# EAGLE design controller (EAGLE 6.4)
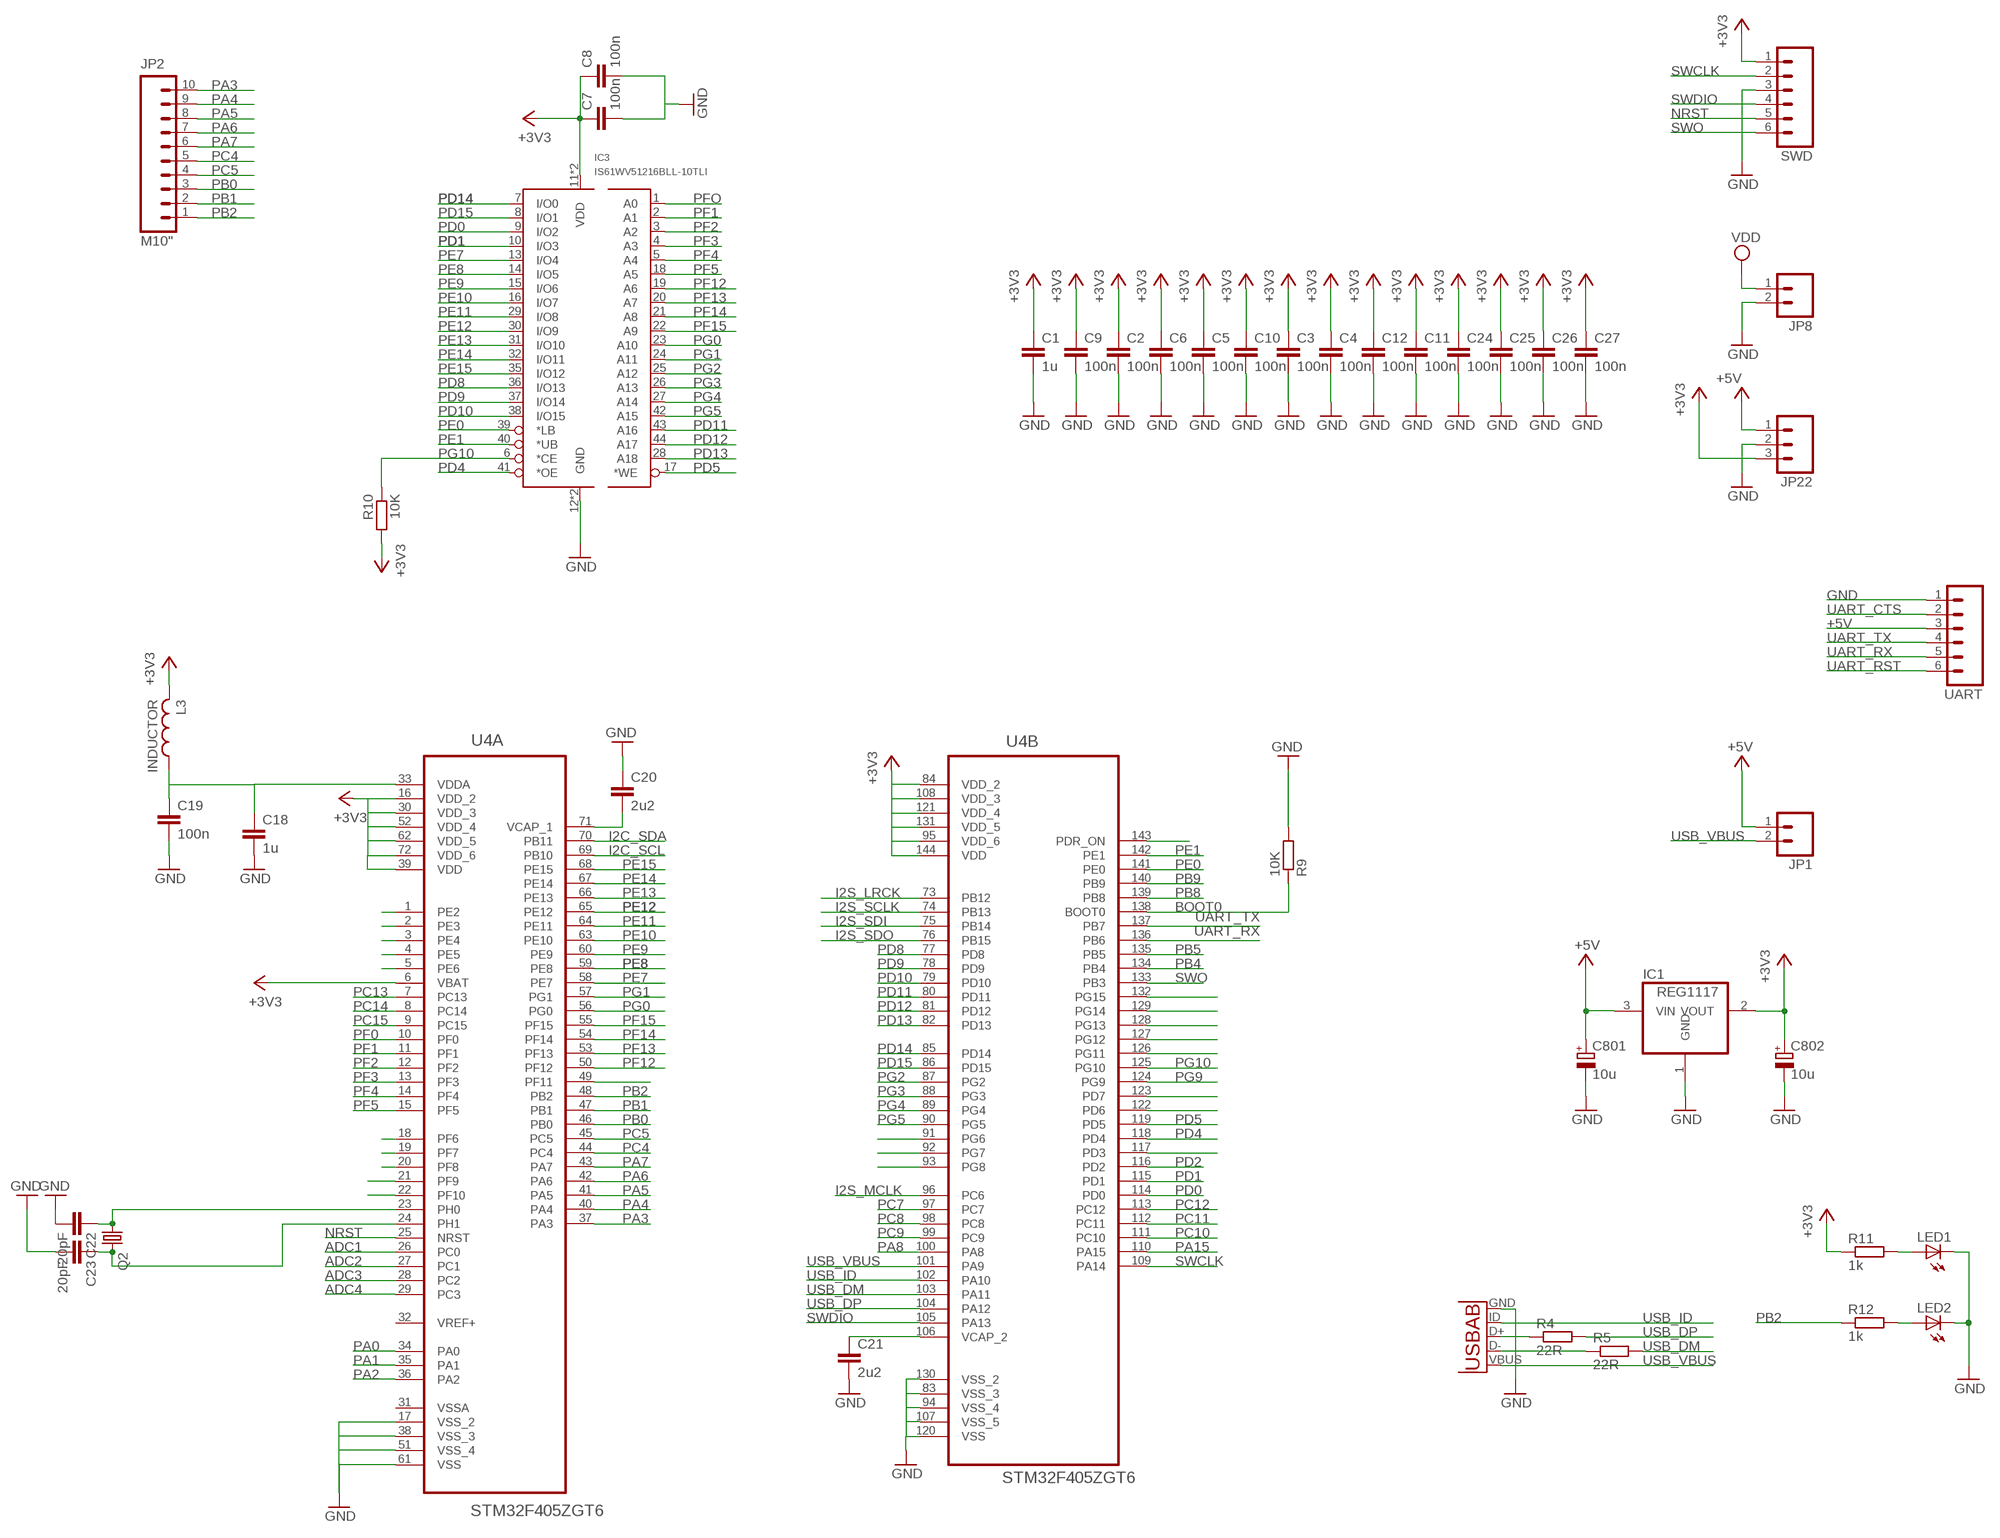
[diagram p0: schematic, sheet 1]

## Parts
C1  1u  C-EUC0603  [C0603]
C2  100n  C-EUC0603  [C0603]
C3  100n  C-EUC0603  [C0603]
C4  100n  C-EUC0603  [C0603]
C5  100n  C-EUC0603  [C0603]
C6  100n  C-EUC0603  [C0603]
C7  100n  C-EUC0603  [C0603]
C8  100n  C-EUC0603  [C0603]
C9  100n  C-EUC0603  [C0603]
C10  100n  C-EUC0603  [C0603]
C11  100n  C-EUC0603  [C0603]
C12  100n  C-EUC0603  [C0603]
C18  1u  C-EUC0603  [C0603]
C19  100n  C-EUC0603  [C0603]
C20  2u2  C-EUC0603  [C0603]
C21  2u2  C-EUC0603  [C0603]
C22  20pF  C-EUC0603  [C0603]
C23  20pF  C-EUC0603  [C0603]
C24  100n  C-EUC0603  [C0603]
C25  100n  C-EUC0603  [C0603]
C26  100n  C-EUC0603  [C0603]
C27  100n  C-EUC0603  [C0603]
C801  10u  CPOL-EUA  [PANASONIC_A]
C802  10u  CPOL-EUA  [PANASONIC_A]
IC1  REG1117  [SOT223]
IC3  IS61WV51216BLL-10TLI  [TSOP44-II]
JP1  M02PTH  [1X02]
JP2  M10"  [1X10]
JP8  M02PTH  [1X02]
JP22  M03PTH  [1X03]
L3  INDUCTOR  [0603]
LED1  LED1206  [LED-1206]
LED2  LED1206  [LED-1206]
Q2  CRYSTALHC49UP  [HC49UP]
R4  22R  R-EU_R0603  [R0603]
R5  22R  R-EU_R0603  [R0603]
R9  10K  R-EU_R0603  [R0603]
R10  10K  R-EU_R0603  [R0603]
R11  1k  R-EU_R0603  [R0603]
R12  1k  R-EU_R0603  [R0603]
SWD  M06SIP  [1X06]
U3  USB-AB  [USB-AB-MICRO-SMD]
U4  STM32F405ZGT6  [QFP50P2200X2200X160-144N]
UART  M06SIP  [1X06]

## Nets
+3V3: C1.1 C2.1 C3.1 C4.1 C5.1 C6.1 C7.1 C8.1 C9.1 C10.1 C11.1 C12.1 C24.1 C25.1 C26.1 C27.1 C802.+ IC1.2(VOUT) IC3.11(VDD) IC3.33(VDD) JP22.3 L3.2 R10.2 R11.1 SWD.1 U4.6(A:VBAT) U4.16(A:VDD_2) U4.30(A:VDD_3) U4.39(A:VDD) U4.52(A:VDD_4) U4.62(A:VDD_5) U4.72(A:VDD_6) U4.84(B:VDD_2) U4.95(B:VDD_6) U4.108(B:VDD_3) U4.121(B:VDD_4) U4.131(B:VDD_5) U4.144(B:VDD)
+5V: C801.+ IC1.3(VIN) JP1.1 JP22.1 UART.3
ADC1: U4.26(A:PC0)
ADC2: U4.27(A:PC1)
ADC3: U4.28(A:PC2)
ADC4: U4.29(A:PC3)
BOOT0: R9.1 U4.138(B:BOOT0)
GND: C1.2 C2.2 C3.2 C4.2 C5.2 C6.2 C7.2 C8.2 C9.2 C10.2 C11.2 C12.2 C18.2 C19.2 C20.1 C21.2 C22.2 C23.2 C24.2 C25.2 C26.2 C27.2 C801.- C802.- IC1.1(GND) IC3.12(GND) IC3.34(GND) JP8.2 JP22.2 LED1.C LED2.C R9.2 SWD.3 U3.GND U4.17(A:VSS_2) U4.38(A:VSS_3) U4.51(A:VSS_4) U4.61(A:VSS) U4.83(B:VSS_3) U4.94(B:VSS_4) U4.107(B:VSS_5) U4.120(B:VSS) U4.130(B:VSS_2) UART.1
I2C_SCL: U4.69(A:PB10)
I2C_SDA: U4.70(A:PB11)
I2S_LRCK: U4.73(B:PB12)
I2S_MCLK: U4.96(B:PC6)
I2S_SCLK: U4.74(B:PB13)
I2S_SDI: U4.75(B:PB14)
I2S_SDO: U4.76(B:PB15)
N$6: U4.49(A:PF11)
N$10: LED1.A R11.2
N$11: LED2.A R12.2
N$12: C21.1 U4.106(B:VCAP_2)
N$14: U4.21(A:PF9)
N$15: U4.22(A:PF10)
N$17: R4.1 U3.D+
N$21: R5.1 U3.D-
N$23: C23.1 Q2.2 U4.24(A:PH1)
N$24: C22.1 Q2.1 U4.23(A:PH0)
N$53: C20.2 U4.71(A:VCAP_1)
N$54: U4.91(B:PG6)
N$75: U4.128(B:PG13)
N$76: U4.129(B:PG14)
N$77: U4.132(B:PG15)
N$99: U4.117(B:PD3)
N$102: U4.122(B:PD6)
N$103: U4.123(B:PD7)
N$106: U4.126(B:PG11)
N$107: U4.127(B:PG12)
N$113: U4.143(B:PDR_ON)
N$123: U4.19(A:PF7)
N$124: U4.18(A:PF6)
N$136: U4.5(A:PE6)
N$137: U4.4(A:PE5)
N$138: U4.3(A:PE4)
N$139: U4.2(A:PE3)
N$140: U4.1(A:PE2)
N$142: U4.93(B:PG8)
N$143: U4.92(B:PG7)
NRST: SWD.5 U4.25(A:NRST)
PA0: U4.34(A:PA0)
PA1: U4.35(A:PA1)
PA2: U4.36(A:PA2)
PA3: JP2.10 U4.37(A:PA3)
PA4: JP2.9 U4.40(A:PA4)
PA5: JP2.8 U4.41(A:PA5)
PA6: JP2.7 U4.42(A:PA6)
PA7: JP2.6 U4.43(A:PA7)
PA8: U4.100(B:PA8)
PA15: U4.110(B:PA15)
PB0: JP2.3 U4.46(A:PB0)
PB1: JP2.2 U4.47(A:PB1)
PB2: JP2.1 R12.1 U4.48(A:PB2)
PB4: U4.134(B:PB4)
PB5: U4.135(B:PB5)
PB8: U4.139(B:PB8)
PB9: U4.140(B:PB9)
PC4: JP2.5 U4.44(A:PC4)
PC5: JP2.4 U4.45(A:PC5)
PC7: U4.97(B:PC7)
PC8: U4.98(B:PC8)
PC9: U4.99(B:PC9)
PC10: U4.111(B:PC10)
PC11: U4.112(B:PC11)
PC12: U4.113(B:PC12)
PC13: U4.7(A:PC13)
PC14: U4.8(A:PC14)
PC15: U4.9(A:PC15)
PD0: IC3.9(I/O2) U4.114(B:PD0)
PD1: IC3.10(I/O3) U4.115(B:PD1)
PD2: U4.116(B:PD2)
PD4: IC3.41(*OE) U4.118(B:PD4)
PD5: IC3.17(*WE) U4.119(B:PD5)
PD8: IC3.36(I/O13) U4.77(B:PD8)
PD9: IC3.37(I/O14) U4.78(B:PD9)
PD10: IC3.38(I/O15) U4.79(B:PD10)
PD11: IC3.43(A16) U4.80(B:PD11)
PD12: IC3.44(A17) U4.81(B:PD12)
PD13: IC3.28(A18) U4.82(B:PD13)
PD14: IC3.7(I/O0) U4.85(B:PD14)
PD15: IC3.8(I/O1) U4.86(B:PD15)
PE0: IC3.39(*LB) U4.141(B:PE0)
PE1: IC3.40(*UB) U4.142(B:PE1)
PE7: IC3.13(I/O4) U4.58(A:PE7)
PE8: IC3.14(I/O5) U4.59(A:PE8)
PE9: IC3.15(I/O6) U4.60(A:PE9)
PE10: IC3.16(I/O7) U4.63(A:PE10)
PE11: IC3.29(I/O8) U4.64(A:PE11)
PE12: IC3.30(I/O9) U4.65(A:PE12)
PE13: IC3.31(I/O10) U4.66(A:PE13)
PE14: IC3.32(I/O11) U4.67(A:PE14)
PE15: IC3.35(I/O12) U4.68(A:PE15)
PF0: U4.10(A:PF0)
PF1: IC3.2(A1) U4.11(A:PF1)
PF2: IC3.3(A2) U4.12(A:PF2)
PF3: IC3.4(A3) U4.13(A:PF3)
PF4: IC3.5(A4) U4.14(A:PF4)
PF5: IC3.18(A5) U4.15(A:PF5)
PF9: U4.20(A:PF8)
PF12: IC3.19(A6) U4.50(A:PF12)
PF13: IC3.20(A7) U4.53(A:PF13)
PF14: IC3.21(A8) U4.54(A:PF14)
PF15: IC3.22(A9) U4.55(A:PF15)
PFO: IC3.1(A0)
PG0: IC3.23(A10) U4.56(A:PG0)
PG1: IC3.24(A11) U4.57(A:PG1)
PG2: IC3.25(A12) U4.87(B:PG2)
PG3: IC3.26(A13) U4.88(B:PG3)
PG4: IC3.27(A14) U4.89(B:PG4)
PG5: IC3.42(A15) U4.90(B:PG5)
PG9: U4.124(B:PG9)
PG10: IC3.6(*CE) R10.1 U4.125(B:PG10)
SWCLK: SWD.2 U4.109(B:PA14)
SWDIO: SWD.4 U4.105(B:PA13)
SWO: SWD.6 U4.133(B:PB3)
UART_CTS: UART.2
UART_RST: UART.6
UART_RX: U4.136(B:PB6) UART.5
UART_TX: U4.137(B:PB7) UART.4
USB_DM: R5.2 U4.103(B:PA11)
USB_DP: R4.2 U4.104(B:PA12)
USB_ID: U3.ID(USBID) U4.102(B:PA10)
USB_VBUS: JP1.2 U3.VBUS U4.101(B:PA9)
VDD: JP8.1
VDDA: C18.1 C19.1 L3.1 U4.33(A:VDDA)
Unconnected: U4.32(A:VREF+)

## Power pins joined to a net without a drawn wire
VSSA: U4.31(A:VSSA)

## Library data of the parts
C1-C12 C18-C27 = resistor:C-EU: CAPACITOR, European symbol
C801 C802 = resistor:CPOL-EU: POLARIZED CAPACITOR, European symbol
IC1 = burr-brown:REG1117: 800mA and 1A Low Dropout (LDO) Positive Regulator 1.8V, 2.5V, 2.85V, 3.3V, 5V, and Adj; MPN: REG1117; OC_FARNELL: 1097566; OC_NEWARK: 14P6981
IC3 = Rebel:IS61WV51216BLL-10TLI: IS61WV51216BLL-10TLI - SRAM, 8MBIT, 10NS, 44TSOPII Manufacturer: INTEGRATED SILICON SOLUTION (ISSI) Farnell order code: 2253837 Manufacturer Part No: IS61WV51216BLL-10TLI Product Information SRAM, 8MBIT, 10NS, 44TSOPII Memory Size: 8Mbit Memory Configuration: 512K x 16bit Supply Voltage Min: 2.4V Supply Voltage Max: 3.6V Memory Case Style: TSOPII No. of Pins: 44 Access Time: 10ns Operating Temperature Min: -40°C Operating Temperature Max: 85°C MSL: MSL 3 - 168 hours SVHC: No SVHC (19-Dec-2012) Operating Temperature Range: -40°C to +85°C Supply Voltage Range: 2.4V to 3.6V
JP1 JP8 = SparkFun:M02: Header 2 Standard 2-pin 0.1" header. Use with straight break away headers (SKU : PRT-00116), right angle break away headers (PRT-00553), swiss pins (PRT-00743), machine pins (PRT-00117), and female headers (PRT-00115). Molex polarized connector foot print use with SKU : PRT-08233 with associated crimp pins and housings.
JP2 = SparkFun:M10: Header 10 Standard 10-pin 0.1" header. Use with straight break away headers (SKU : PRT-00116), right angle break away headers (PRT-00553), swiss pins (PRT-00743), machine pins (PRT-00117), and female headers (PRT-00115).
JP22 = SparkFun:M03: Header 3 Standard 3-pin 0.1" header. Use with straight break away headers (SKU : PRT-00116), right angle break away headers (PRT-00553), swiss pins (PRT-00743), machine pins (PRT-00117), and female headers (PRT-00115). Molex polarized connector foot print use with SKU : PRT-08232 with associated crimp pins and housings.
L3 = Rebel:INDUCTOR
LED1 LED2 = SparkFun:LED: LEDs Standard schematic elements and footprints for 5mm, 3mm, 1206, and 0603 sized LEDs. 5mm - Spark Fun Electronics SKU : COM-00529 (and others)
Q2 = crystal:CRYSTAL: CRYSTAL; OC_FARNELL: unknown; OC_NEWARK: unknown
R4 R5 R9-R12 = resistor:R-EU_: RESISTOR, European symbol
SWD UART = SparkFun:M06: Header 6 Standard 6-pin 0.1" header. Use with straight break away headers (SKU : PRT-00116), right angle break away headers (PRT-00553), swiss pins (PRT-00743), machine pins (PRT-00117), and female headers (PRT-00115). Molex polarized connector foot print use with SKU : PRT-08094 with associated crimp pins and housings. NOTES ON THE VARIANTS LOCK and LOCK_LONGPADS... This footprint was designed to help hold the alignment of a through-hole component (i.e. 6-pin header) while soldering it into place. You may notice that each hole has been shifted either up or down by 0.005 of an inch from it's more standard position (which is a perfectly straight line). This slight alteration caused the pins (the squares in the middle) to touch the edges of the holes. Because they are alternating, it causes a "brace" to hold the component in place. 0.005 has proven to be the perfect amount of "off-center" position when using our standard breakaway headers. Although looks a little odd when you look at the bare footprint, once you have a header in there, the alteration is very hard to notice. Also, if you push a header all the way into place, it is covered up entirely on the bottom side. This idea of altering the position of holes to aid alignment will be further integrated into the Sparkfun Library for other footprints. It can help hold any component with 3 or more connection pins.
U3 = SparkFun-Connectors:USB-AB: This is a USB AB connector that is compatible with USB OTG. i.e. this connector can serve as a host or device
U4 = Rebel:STM32F405ZGT6: IC, MCU, 32BIT, 1MB FLASH, 144LQFP; MPN: STM32F405ZGT6; OC_FARNELL: 2215225; OC_NEWARK: 46W2200; PACKAGE: 144LQFP; SUPPLIER: STMicroelectronics

## Board
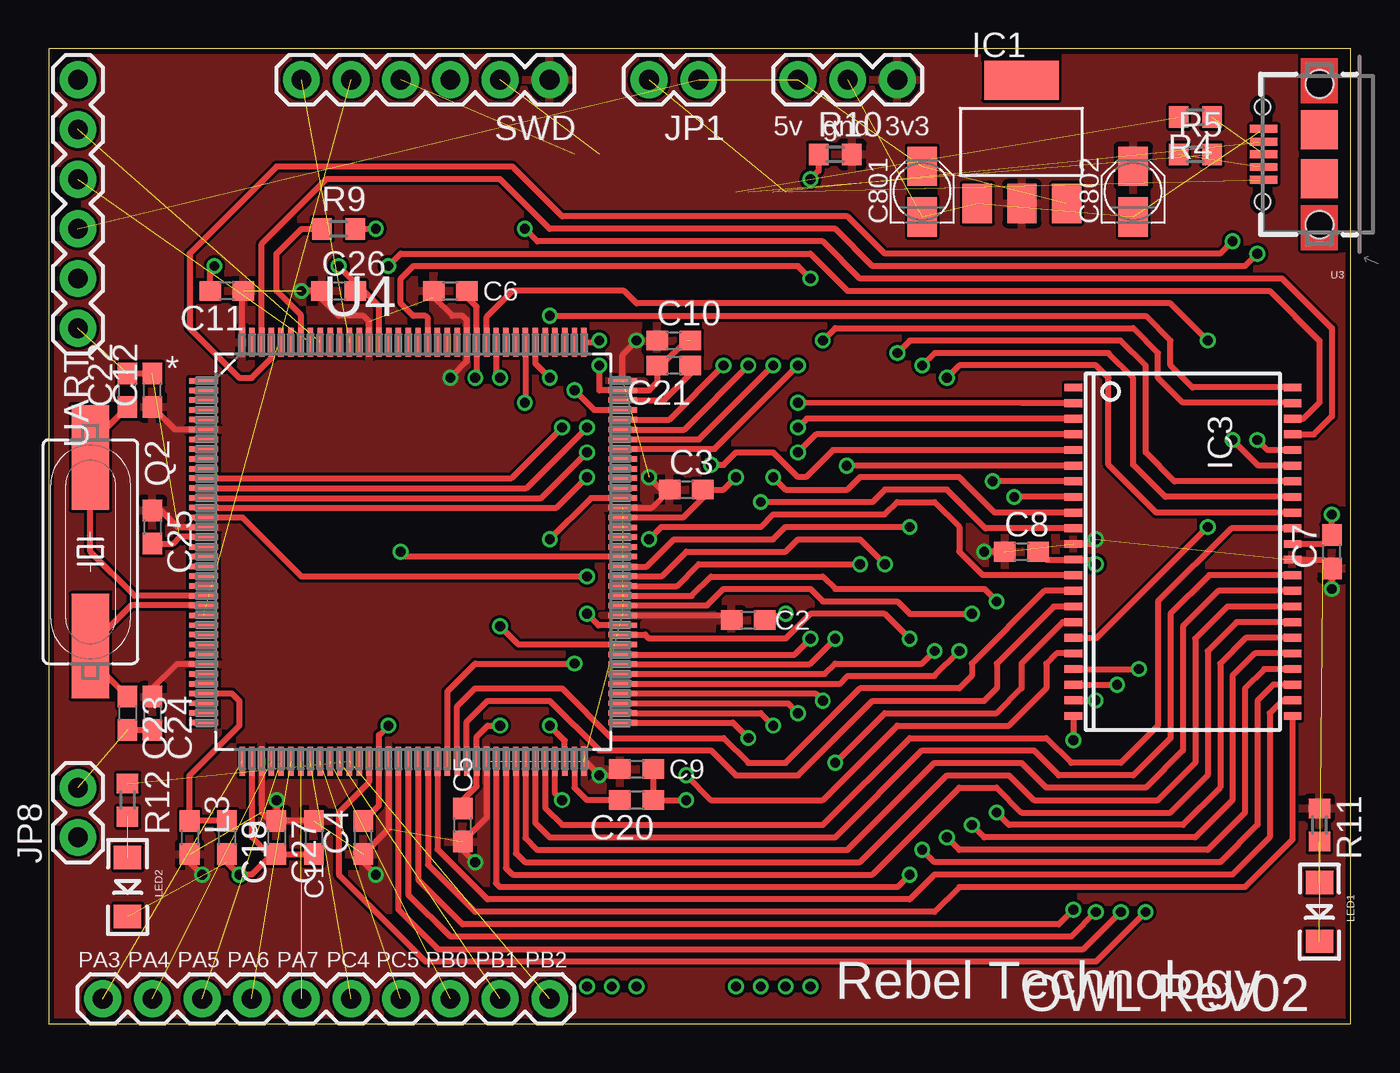
[diagram p1: board, top side]
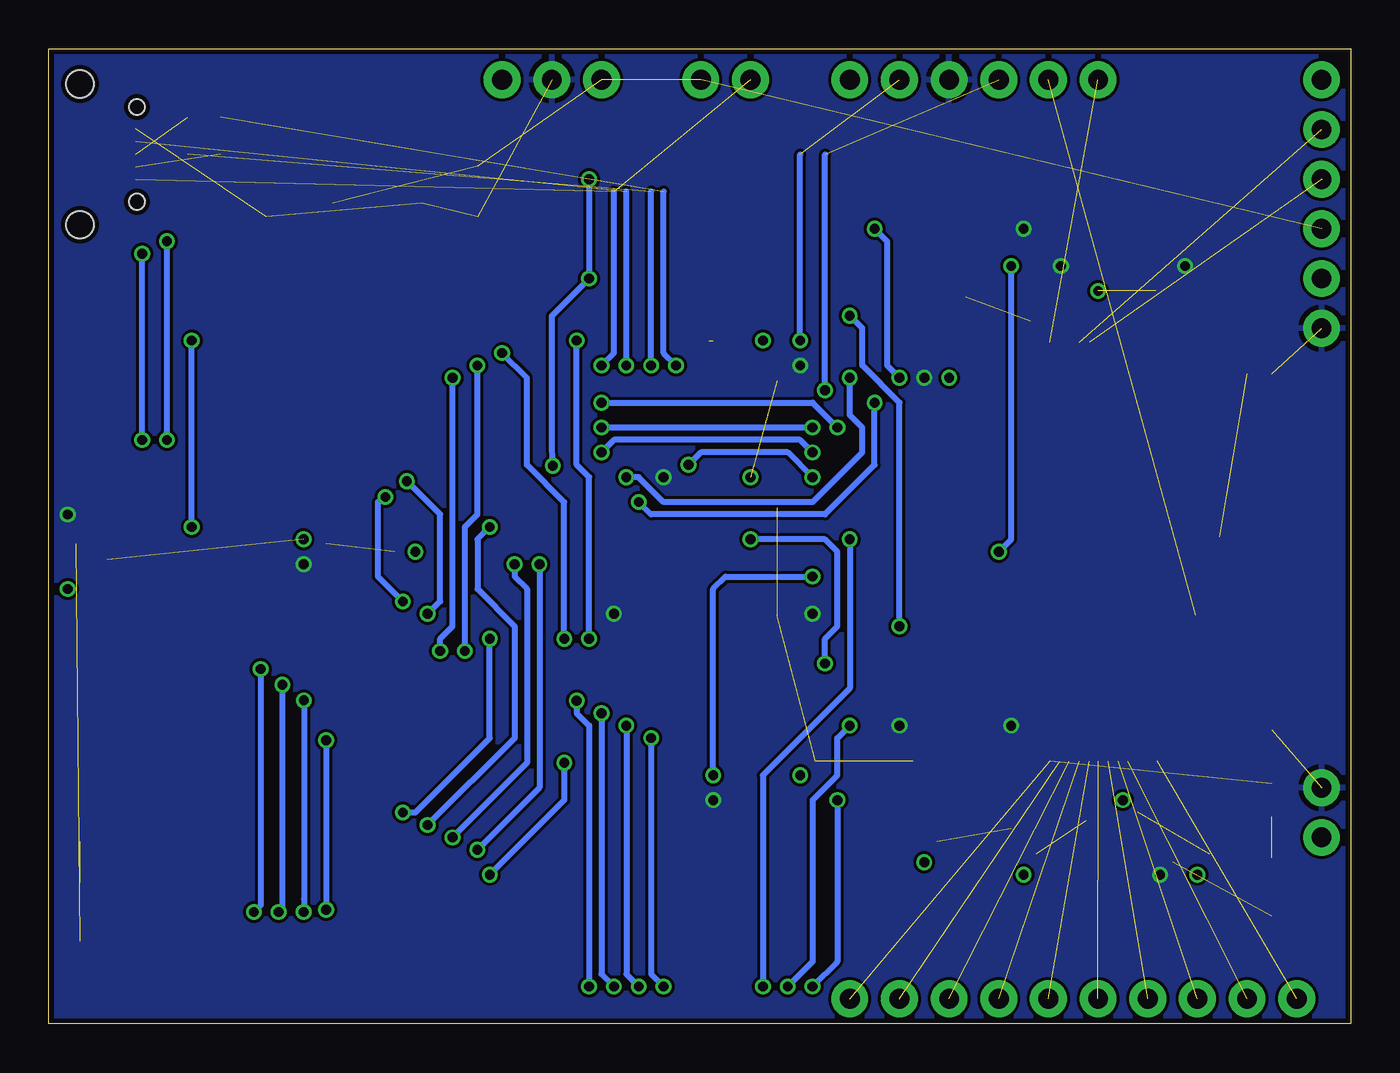
[diagram p2: board, bottom side, seen from below]

Size 66.58 x 49.84 mm. Coordinates in mm from the lower left corner, seen from the top.
Outline: 0,0 66.58,0 66.58,49.84 0,49.84 0,0
Copper layers (1*16): Top 0.035mm / dielectric 1.5mm / Bottom 0.035mm
Design rules "default *": minimum track width 6mil, minimum drill 12mil, track to track 6mil, track to pad 6mil, pad to pad 6mil, via to via 6mil, smd to smd 0mil, copper to edge 10mil, drill to drill 10mil, minimum pad ring 12mil, minimum via ring 6mil, stop-mask expansion 2mil, vias tented up to drill 100mil, thermal gap 10mil

### Footprints (pad centres in the part's own frame; a part is rotated, then mirrored left to right if it is on the bottom)
C0603 = smd 1.1 x 1: 1 -0.85,0; 2 0.85,0
PANASONIC_A = smd 2 x 1.5: + 1.3,0; - -1.3,0
SOT223 = smd 1.499 x 2.007: 1 -2.261,-3.15; 2 0.025,-3.15; 3 2.311,-3.15 | smd 3.81 x 2.007: 4 0,3.15
TSOP44-II = smd 0.4 x 0.9: 1 -8.4,-5.6; 2 -7.6,-5.6; 3 -6.8,-5.6; 4 -6,-5.6; 5 -5.2,-5.6; 6 -4.4,-5.6; 7 -3.6,-5.6; 8 -2.8,-5.6; 9 -2,-5.6; 10 -1.2,-5.6; 11 -0.4,-5.6; 12 0.4,-5.6; 13 1.2,-5.6; 14 2,-5.6; 15 2.8,-5.6; 16 3.6,-5.6; 17 4.4,-5.6; 18 5.2,-5.6; 19 6,-5.6; 20 6.8,-5.6; 21 7.6,-5.6; 22 8.4,-5.6; 23 8.4,5.6; 24 7.6,5.6; 25 6.8,5.6; 26 6,5.6; 27 5.2,5.6; 28 4.4,5.6; 29 3.6,5.6; 30 2.8,5.6; 31 2,5.6; 32 1.2,5.6; 33 0.4,5.6; 34 -0.4,5.6; 35 -1.2,5.6; 36 -2,5.6; 37 -2.8,5.6; 38 -3.6,5.6; 39 -4.4,5.6; 40 -5.2,5.6; 41 -6,5.6; 42 -6.8,5.6; 43 -7.6,5.6; 44 -8.4,5.6
1X02 = drill 1.016 pad 1.88: 1 0,0; 2 2.54,0
1X10 = drill 1.016 pad 1.88: 1 0,0; 2 2.54,0; 3 5.08,0; 4 7.62,0; 5 10.16,0; 6 12.7,0; 7 15.24,0; 8 17.78,0; 9 20.32,0; 10 22.86,0
1X03 = drill 1.016 pad 1.88: 1 0,0; 2 2.54,0; 3 5.08,0
0603 = smd 1.1 x 1: 1 -0.85,0; 2 0.85,0
LED-1206 = smd 1.2 x 1.4: A -1.5,0; C 1.5,0
HC49UP = smd 5.334 x 1.93: 1 -4.826,0; 2 4.826,0
R0603 = smd 1 x 1.1: 1 -0.85,0; 2 0.85,0
1X06 = drill 1.016 pad 1.88: 1 0,0; 2 2.54,0; 3 5.08,0; 4 7.62,0; 5 10.16,0; 6 12.7,0
USB-AB-MICRO-SMD = smd 1.4 x 0.4: D+ 2.85,0; D- 2.85,0.65; GND 2.85,-1.3; ID 2.85,-0.65; VBUS 2.85,1.3 | smd 1.9 x 2: P$6 0,1.25; P$7 0,-1.25 | hole 1.4: 0,3.6; 0,-3.6 | hole 0.8: 2.9,2.425; 2.9,-2.425
QFP50P2200X2200X160-144N = smd 1.473 x 0.279: 1 -10.719,8.738; 2 -10.719,8.255; 3 -10.719,7.747; 4 -10.719,7.239; 5 -10.719,6.756; 6 -10.719,6.248; 7 -10.719,5.74; 8 -10.719,5.258; 9 -10.719,4.75; 10 -10.719,4.242; 11 -10.719,3.759; 12 -10.719,3.251; 13 -10.719,2.743; 14 -10.719,2.261; 15 -10.719,1.753; 16 -10.719,1.245; 17 -10.719,0.762; 18 -10.719,0.254; 19 -10.719,-0.254; 20 -10.719,-0.762; 21 -10.719,-1.245; 22 -10.719,-1.753; 23 -10.719,-2.261; 24 -10.719,-2.743; 25 -10.719,-3.251; 26 -10.719,-3.759; 27 -10.719,-4.242; 28 -10.719,-4.75; 29 -10.719,-5.258; 30 -10.719,-5.74; 31 -10.719,-6.248; 32 -10.719,-6.756; 33 -10.719,-7.239; 34 -10.719,-7.747; 35 -10.719,-8.255; 36 -10.719,-8.738; 73 10.719,-8.738; 74 10.719,-8.255; 75 10.719,-7.747; 76 10.719,-7.239; 77 10.719,-6.756; 78 10.719,-6.248; 79 10.719,-5.74; 80 10.719,-5.258; 81 10.719,-4.75; 82 10.719,-4.242; 83 10.719,-3.759; 84 10.719,-3.251; 85 10.719,-2.743; 86 10.719,-2.261; 87 10.719,-1.753; 88 10.719,-1.245; 89 10.719,-0.762; 90 10.719,-0.254; 91 10.719,0.254; 92 10.719,0.762; 93 10.719,1.245; 94 10.719,1.753; 95 10.719,2.261; 96 10.719,2.743; 97 10.719,3.251; 98 10.719,3.759; 99 10.719,4.242; 100 10.719,4.75; 101 10.719,5.258; 102 10.719,5.74; 103 10.719,6.248; 104 10.719,6.756; 105 10.719,7.239; 106 10.719,7.747; 107 10.719,8.255; 108 10.719,8.738 | smd 0.279 x 1.473: 37 -8.738,-10.719; 38 -8.255,-10.719; 39 -7.747,-10.719; 40 -7.239,-10.719; 41 -6.756,-10.719; 42 -6.248,-10.719; 43 -5.74,-10.719; 44 -5.258,-10.719; 45 -4.75,-10.719; 46 -4.242,-10.719; 47 -3.759,-10.719; 48 -3.251,-10.719; 49 -2.743,-10.719; 50 -2.261,-10.719; 51 -1.753,-10.719; 52 -1.245,-10.719; 53 -0.762,-10.719; 54 -0.254,-10.719; 55 0.254,-10.719; 56 0.762,-10.719; 57 1.245,-10.719; 58 1.753,-10.719; 59 2.261,-10.719; 60 2.743,-10.719; 61 3.251,-10.719; 62 3.759,-10.719; 63 4.242,-10.719; 64 4.75,-10.719; 65 5.258,-10.719; 66 5.74,-10.719; 67 6.248,-10.719; 68 6.756,-10.719; 69 7.239,-10.719; 70 7.747,-10.719; 71 8.255,-10.719; 72 8.738,-10.719; 109 8.738,10.719; 110 8.255,10.719; 111 7.747,10.719; 112 7.239,10.719; 113 6.756,10.719; 114 6.248,10.719; 115 5.74,10.719; 116 5.258,10.719; 117 4.75,10.719; 118 4.242,10.719; 119 3.759,10.719; 120 3.251,10.719; 121 2.743,10.719; 122 2.261,10.719; 123 1.753,10.719; 124 1.245,10.719; 125 0.762,10.719; 126 0.254,10.719; 127 -0.254,10.719; 128 -0.762,10.719; 129 -1.245,10.719; 130 -1.753,10.719; 131 -2.261,10.719; 132 -2.743,10.719; 133 -3.251,10.719; 134 -3.759,10.719; 135 -4.242,10.719; 136 -4.75,10.719; 137 -5.258,10.719; 138 -5.74,10.719; 139 -6.248,10.719; 140 -6.756,10.719; 141 -7.239,10.719; 142 -7.747,10.719; 143 -8.255,10.719; 144 -8.738,10.719

### Placement (x,y rotation side)
C1  13.55,9.53 270 top
C2  35.78,20.64 0 top
C3  32.6,27.3 0 top
C4  16.09,9.53 90 top
C5  21.17,10.16 90 top
C6  20.54,37.47 0 top
C7  65.62,24.13 90 top
C8  49.75,24.13 0 top
C9  30.06,13.02 0 top
C10  31.97,34.92 0 top
C11  9.11,37.47 180 top
C12  5.3,32.38 90 top
C18  9.11,9.53 270 top
C19  9.11,9.53 270 top
C20  30.06,11.43 180 top
C21  31.97,33.66 180 top
C22  4.03,32.38 90 top
C23  4.03,15.88 270 top
C24  5.3,15.88 270 top
C25  5.3,25.4 270 top
C26  14.82,37.47 0 top
C27  11.65,9.53 270 top
C801  44.67,42.55 90 top
C802  55.46,42.55 90 top
IC1  49.75,45.09 0 top
IC3  58,24.13 270 top
JP1  33.24,48.26 180 top
JP2  25.62,1.27 180 top
JP8  1.49,9.53 90 top
JP22  38.32,48.26 0 top
L3  7.2,9.53 270 top
LED1  64.99,5.71 270 top
LED2  4.03,6.99 270 top
Q2  2.12,24.13 270 top
R4  58.64,46.35 180 top
R5  58.64,44.45 0 top
R9  14.82,40.64 0 top
R10  40.22,44.45 0 top
R11  64.99,10.16 270 top
R12  4.03,11.43 270 top
SWD  25.62,48.26 180 top
U3  64.99,44.45 180 top
U4  18.63,24.13 0 top
UART  1.49,35.56 90 top

### Tracks (layer width: path | path; a pad name or v marks a point on that pad's centre or on a via)
+3V3  (via drill 0.5)  (11 unrouted)
  Top 0.305: U4.72 27.45,13.41 v28.16,12.7 28.89,12.7 C9.1 | C8.1 v47.84,24.13 | IC3.11 53.32,24.53 v53.56,24.77 | U4.108 29.35,34.21 v30.06,34.92 | v20.54,33.02 21.37,33.86 U4.121 21.37,35.99 21.17,36.2 20.64,36.2 19.69,37.15 C6.1 | U4.84 34.69,20.88 C2.1 | U4.62 22.39,10.53 C5.1 21.17,8.89 v21.81,8.26 | U4.95 30.84,26.39 C3.1 31.33,27.3 v30.7,27.94 | U4.52 17.39,9.97 C4.1 16.09,8.26 v16.73,7.62 | U4.131 16.37,35.92 16.09,36.2 14.82,36.2 13.97,37.05 C26.1 v12.92,37.47 | U4.144 9.89,37.4 C11.1 | U4.6 6.45,30.38 C12.1 | C24.1 5.3,17.14 6.54,18.39 U4.30 | U4.16 6.59,25.38 5.72,26.25 C25.1 | U4.39 10.88,10.82 11.33,10.38 C27.1 | L3.2 7.2,8.26 v7.84,7.62 | C1.1 C27.1 | v11.65,11.43 C27.1 | IC3.33 65.17,23.73 C7.1 v65.62,22.23
  pour Top: -0.42,50.16 -0.42,-0.64 68.16,-0.64 68.16,50.16
+5V  (4 unrouted)
BOOT0
  Top 0.305: U4.138 12.89,36.22 11.65,37.47 11.65,39.37 12.92,40.64 R9.1
GND  (via drill 0.5)  (10 unrouted)
  Top 0.305: v32.6,11.43 C20.1 C9.2 | C8.2 51,23.73 IC3.12 53.32,23.73 v53.56,23.5 | 32.6,34.92 31.33,33.66 C21.2 31.12,32.8 30.7,32.38 U4.107 28.16,32.38 v28.16,33.66 | v21.81,33.02 21.88,33.1 U4.120 21.88,36.65 21.39,37.15 C6.2 | C2.2 36.63,20.74 v37.68,20.95 | v23.08,15.24 22.44,15.24 21.88,14.68 U4.61 21.88,12.14 21.17,11.43 C5.2 | v35.14,27.94 34.51,27.3 C3.2 33.45,26.89 32.45,25.88 U4.94 | C4.2 16.88,11.16 U4.51 16.88,14.76 v17.36,15.24 | U4.130 16.88,36.68 16.09,37.47 C26.2 15.67,37.88 v14.82,38.73 | C11.2 8.26,38.52 v8.47,38.73 | C12.2 C22.2 | C23.2 C24.2 | U4.17 6.69,24.89 6.35,24.55 C25.2 | U4.38 10.38,9.53 11.23,8.68 C27.2 | U4.83 28.11,20.37 v27.52,20.95 | C19.2 9.11,8.26 v9.74,7.62 10.38,7.62 11.43,8.68 C27.2 | C27.2 C1.2 | IC3.34 65.17,24.53 C7.2 v65.62,26.04 | R9.2 v16.73,40.64
  pour Bottom: -0.42,-0.64 -0.42,50.16 68.16,50.16 68.16,-0.64
I2C_SCL  (via drill 0.5)
  Top 0.305: U4.69 25.87,11.81 v26.25,11.43
  Bottom 0.305: v26.25,11.43 26.25,3.17 v27.52,1.91
I2C_SDA  (via drill 0.5)
  Top 0.305: U4.70 26.38,14.48 v25.62,15.24
  Bottom 0.305: v28.79,1.91 27.52,3.17 27.52,11.43 26.25,12.7 26.25,14.61 v25.62,15.24
I2S_LRCK  (via drill 0.5)
  Top 0.305: U4.73 34.99,15.39 v35.78,14.61
  Bottom 0.305: v35.78,14.61 35.78,2.54 v35.14,1.91
I2S_MCLK  (via drill 0.5)
  Top 0.305: U4.96 27.72,26.87 v25.62,24.77
  Bottom 0.305: v25.62,24.77 25.62,17.14 30.06,12.7 v30.06,1.91
I2S_SCLK  (via drill 0.5)
  Top 0.305: U4.74 36.41,15.88 v37.05,15.24
  Bottom 0.305: v37.05,15.24 37.05,2.54 v36.41,1.91
I2S_SDI  (via drill 0.5)
  Top 0.305: U4.75 37.81,16.38 v38.32,15.88
  Bottom 0.305: v38.32,15.88 38.32,2.54 v37.68,1.91
I2S_SDO  (via drill 0.5)
  Top 0.305: U4.76 39.21,16.89 v39.59,16.51
  Bottom 0.305: v39.59,16.51 39.59,15.88 38.95,15.24 v38.95,1.91
N$10  (1 unrouted)
N$11  (1 unrouted)
N$12
  Top 0.305: U4.106 31.46,31.88 32.82,33.23 C21.1
N$17  (1 unrouted)
N$21  (1 unrouted)
N$23
  Top 0.305: U4.24 4.2,21.39 Q2.2 2.12,18.63 C23.1
N$24
  Top 0.305: U4.23 4.38,21.87 2.12,24.13 Q2.1 | Q2.1 2.12,28.57 | Q2.1 2.12,29.63 C22.1
N$53
  Top 0.305: U4.71 26.89,12.06 27.52,11.43 C20.2
NRST  (1 unrouted)
PA3  (1 unrouted)
PA4  (1 unrouted)
PA5  (1 unrouted)
PA6  (1 unrouted)
PA7  (1 unrouted)
PB0  (1 unrouted)
PB1  (1 unrouted)
PB2  (2 unrouted)
PC4  (1 unrouted)
PC5  (1 unrouted)
PD0  (via drill 0.5)
  Top 0.305: IC3.9 48.38,26.13 46.57,27.94 41.49,27.94 40.86,27.3 37.68,27.3 v37.05,27.94 | U4.114 24.88,33.76 v25.62,33.02
  Bottom 0.305: v25.62,33.02 25.62,31.11 24.98,30.48 24.98,29.21 27.52,26.67 35.14,26.67 36.41,27.94 v37.05,27.94
PD1  (via drill 0.5)
  Top 0.305: IC3.10 47.91,25.33 45.94,27.3 42.76,27.3 42.13,26.67 v36.41,26.67 | U4.115 24.37,31.77 v24.35,31.75
  Bottom 0.305: v36.41,26.67 35.78,26.04 26.89,26.04 24.35,28.57 v24.35,31.75
PD4  (via drill 0.5)
  Top 0.305: v24.35,40.64 24.98,40.01 39.59,40.01 41.49,38.1 63.08,38.1 65.62,35.56 65.62,31.05 64.7,30.13 IC3.41 | U4.118 22.87,33.22 v23.08,33.02
  Bottom 0.305: v24.35,40.64 23.71,40.01 23.71,33.66 v23.08,33.02
PD5  (via drill 0.5)
  Top 0.305: IC3.17 53.6,19.73 v59.27,25.4 | v59.27,34.92 57.37,36.83 30.06,36.83 29.43,37.47 23.71,37.47 22.39,36.14 U4.119
  Bottom 0.305: v59.27,25.4 v59.27,34.92
PD8  (via drill 0.5)
  Top 0.305: IC3.36 56.64,26.13 54.19,28.57 54.19,33.02 53.56,33.66 46.57,33.66 v45.94,33.02 | v46.57,19.05 45.3,17.78 40.86,17.78 40.45,17.37 U4.77
  Bottom 0.305: v46.57,19.05 46.57,19.68 45.94,20.32 v45.94,33.02
PD9  (via drill 0.5)
  Top 0.305: IC3.37 57.11,26.93 55.46,28.57 55.46,33.02 54.19,34.29 45.3,34.29 v44.67,33.66 | v45.3,19.05 44.67,18.41 40.22,18.41 39.69,17.88 U4.78
  Bottom 0.305: v45.3,19.05 45.3,25.4 44.67,26.04 v44.67,33.66
PD10  (via drill 0.5)
  Top 0.305: IC3.38 57.58,27.73 56.1,29.21 56.1,33.66 54.83,34.92 44.03,34.92 v43.4,34.29 | U4.79 38.93,18.39 v40.22,19.68
  Bottom 0.305: v40.22,19.68 40.22,26.67 42.13,28.57 42.13,33.02 v43.4,34.29
PD11  (via drill 0.5)
  Top 0.305: U4.80 38.14,18.87 v38.95,19.68 | v39.59,34.92 40.22,35.56 55.46,35.56 56.73,34.29 56.73,33.02 58,31.75 63.58,31.75 IC3.43
  Bottom 0.305: v38.95,19.68 38.95,27.94 39.59,28.57 v39.59,34.92
PD12  (via drill 0.5)
  Top 0.305: U4.81 24.02,19.38 v23.08,20.32 | v25.62,36.2 56.1,36.2 57.37,34.92 57.37,33.66 58.49,32.53 IC3.44
  Bottom 0.305: v23.08,20.32 23.08,31.75 24.98,33.66 24.98,35.56 v25.62,36.2
PD13  (via drill 0.5)
  Top 0.305: IC3.28 61.22,19.73 59.91,18.41 59.91,12.06 58,10.16 49.11,10.16 v48.48,10.79 | U4.82 30.49,19.89 30.7,19.68 37.68,19.68 38.95,20.95 42.76,20.95 v44.03,19.68
  Bottom 0.305: v48.48,10.79 47.84,10.79 44.03,14.61 v44.03,19.68
PD14  (via drill 0.5)
  Top 0.305: IC3.7 v48.27,27.73 | U4.85 33.67,21.39 34.51,22.23 38.95,22.23 39.59,21.59 43.4,21.59 44.03,20.95 v47.21,20.95
  Bottom 0.305: v48.27,27.73 46.57,26.04 46.57,21.59 v47.21,20.95
PD15  (via drill 0.5)
  Top 0.305: IC3.8 v49.37,26.93 | U4.86 32.88,21.87 33.87,22.86 39.59,22.86 40.22,22.23 47.84,22.23 v48.48,21.59
  Bottom 0.305: v49.37,26.93 49.75,26.67 49.75,22.86 v48.48,21.59
PE0  (via drill 0.5)
  Top 0.305: v60.54,40.01 59.91,39.37 42.76,39.37 40.86,41.27 26.25,41.27 23.71,43.81 11.65,43.81 7.2,39.37 7.2,35.56 9.74,33.02 10.38,33.02 11.39,34.04 U4.141 | IC3.39 61.86,28.53 v60.54,29.84
  Bottom 0.305: v60.54,29.84 v60.54,40.01
PE1  (via drill 0.5)
  Top 0.305: v61.81,39.37 61.18,38.73 42.13,38.73 40.22,40.64 25.62,40.64 23.08,43.18 14.19,43.18 10.88,39.88 U4.142 | IC3.40 62.33,29.33 v61.81,29.84
  Bottom 0.305: v61.81,29.84 v61.81,39.37
PE7  (via drill 0.5)
  Top 0.305: U4.58 20.38,16.99 21.81,18.41 v26.89,18.41 | v30.7,24.77 31.33,25.4 36.41,25.4 37.05,26.04 42.76,26.04 43.4,26.67 45.3,26.67 46.57,25.4 46.57,24.13 47.77,22.93 IC3.13
  Bottom 0.305: v26.89,18.41 26.89,19.68 26.25,20.32 26.25,24.13 26.89,24.77 v30.7,24.77
PE8
  Top 0.305: IC3.14 50.92,22.13 47.21,18.41 47.21,17.78 46.57,17.14 41.49,17.14 37.68,13.34 35.78,13.34 34.51,14.61 28.79,14.61 26.25,17.14 21.81,17.14 20.89,16.23 U4.59
PE9
  Top 0.305: IC3.15 51.39,21.33 48.48,18.41 48.48,17.14 47.84,16.51 42.13,16.51 38.32,12.7 35.14,12.7 33.87,13.97 28.16,13.97 25.62,16.51 22.44,16.51 21.37,15.44 U4.60
PE10  (via drill 0.5)
  Top 0.305: IC3.16 51.86,20.53 49.75,18.41 49.75,17.14 48.48,15.88 42.76,15.88 v40.22,13.34 | v44.03,7.62 43.4,6.99 23.08,6.99 22.87,7.19 U4.63
  Bottom 0.305: v40.22,13.34 40.22,11.43 v44.03,7.62
PE11
  Top 0.305: IC3.29 60.75,20.53 59.27,19.05 59.27,12.7 57.37,10.79 49.75,10.79 48.48,12.06 46.57,12.06 42.13,7.62 23.71,7.62 23.38,7.95 U4.64
PE12
  Top 0.305: IC3.30 60.28,21.33 58.64,19.68 58.64,13.34 56.73,11.43 50.38,11.43 49.11,12.7 45.94,12.7 41.49,8.26 24.35,8.26 23.89,8.71 U4.65
PE13
  Top 0.305: IC3.31 59.81,22.13 58,20.32 58,13.97 56.1,12.06 51.02,12.06 49.75,13.34 45.3,13.34 40.86,8.89 24.98,8.89 24.37,9.5 U4.66
PE14
  Top 0.305: IC3.32 59.34,22.93 57.37,20.95 57.37,14.61 55.46,12.7 51.65,12.7 50.38,13.97 44.67,13.97 40.22,9.53 25.62,9.53 24.88,10.26 U4.67
PE15
  Top 0.305: IC3.35 60.47,25.33 56.73,21.59 56.73,15.24 54.83,13.34 52.29,13.34 51.02,14.61 44.03,14.61 39.59,10.16 26.25,10.16 25.39,11.02 U4.68
PF1  (via drill 0.5)
  Top 0.305: IC3.2 49.77,31.73 v38.32,31.75 | U4.11 23.66,27.89 v26.25,30.48
  Bottom 0.305: v38.32,31.75 27.52,31.75 v26.25,30.48
PF2  (via drill 0.5)
  Top 0.305: IC3.3 38.77,30.93 v38.32,30.48 | U4.12 24.42,27.38 v27.52,30.48
  Bottom 0.305: v27.52,30.48 v38.32,30.48
PF3  (via drill 0.5)
  Top 0.305: IC3.4 39.24,30.13 v38.32,29.21 | v27.52,29.21 25.18,26.87 U4.13
  Bottom 0.305: v27.52,29.21 28.16,29.84 37.68,29.84 v38.32,29.21
PF4  (via drill 0.5)
  Top 0.305: IC3.5 40.1,29.33 38.71,27.94 38.32,27.94 37.05,29.21 35.14,29.21 34.51,28.57 v33.87,28.57 | v27.52,27.94 25.97,26.39 U4.14
  Bottom 0.305: v27.52,27.94 28.79,29.21 33.24,29.21 v33.87,28.57
PF5  (via drill 0.5)
  Top 0.305: IC3.18 51.53,18.93 51.02,18.41 51.02,17.14 49.11,15.24 43.4,15.24 39.59,11.43 33.87,11.43 v32.6,12.7 | U4.15 9.89,25.88 12.92,22.86 v27.52,22.86
  Bottom 0.305: v32.6,12.7 32.6,22.23 31.97,22.86 v27.52,22.86
PF12  (via drill 0.5)
  Top 0.305: IC3.19 v55.75,18.13 | v56.1,5.71 53.56,3.17 19.27,3.17 14.82,7.62 14.82,10.79 16.37,12.34 U4.50
  Bottom 0.305: v55.75,18.13 55.75,6.07 v56.1,5.71
PF13  (via drill 0.5)
  Top 0.305: U4.53 17.87,5.84 19.9,3.81 52.92,3.81 v54.83,5.71 | IC3.20 v54.64,17.33
  Bottom 0.305: v54.64,17.33 54.64,5.9 v54.83,5.71
PF14  (via drill 0.5)
  Top 0.305: IC3.21 v53.54,16.53 | U4.54 18.38,6.6 20.54,4.45 52.29,4.45 v53.56,5.71
  Bottom 0.305: v53.54,16.53 53.54,6.37 v53.56,5.71
PF15  (via drill 0.5)
  Top 0.305: IC3.22 v52.4,14.49 | U4.55 18.88,7.37 21.17,5.08 51.65,5.08 v52.4,5.83
  Bottom 0.305: v52.4,14.49 v52.4,5.83
PG0
  Top 0.305: IC3.23 63.6,9.41 61.18,6.99 46.57,6.99 45.3,5.71 21.81,5.71 19.39,8.13 U4.56
PG1
  Top 0.305: IC3.24 63.1,16.53 62.45,15.88 62.45,9.53 60.54,7.62 45.3,7.62 44.03,6.35 22.44,6.35 19.88,8.91 U4.57
PG2  (via drill 0.5)
  Top 0.305: IC3.25 62.63,17.33 61.81,16.51 61.81,10.16 59.91,8.26 45.3,8.26 v44.67,8.89 | U4.87 32.12,22.38 33.24,23.5 v41.49,23.5
  Bottom 0.305: v41.49,23.5 41.49,12.06 v44.67,8.89
PG3  (via drill 0.5)
  Top 0.305: IC3.26 62.16,18.13 61.18,17.14 61.18,10.79 59.27,8.89 46.57,8.89 v45.94,9.53 | U4.88 31.36,22.89 32.6,24.13 37.68,24.13 38.32,24.77 41.49,24.77 v42.76,23.5
  Bottom 0.305: v42.76,23.5 42.76,22.86 42.13,22.23 42.13,13.34 v45.94,9.53
PG4  (via drill 0.5)
  Top 0.305: IC3.27 61.69,18.93 60.54,17.78 60.54,11.43 58.64,9.53 47.84,9.53 v47.21,10.16 | U4.89 30.57,23.37 31.97,24.77 37.05,24.77 37.68,25.4 v44.03,25.4
  Bottom 0.305: v44.03,25.4 44.67,24.77 44.67,22.23 42.76,20.32 42.76,14.61 v47.21,10.16
PG5  (via drill 0.5)
  Top 0.305: U4.90 18.25,23.88 v18,24.13 | v17.36,38.73 18,39.37 38.95,39.37 40.86,37.47 62.45,37.47 64.99,34.92 64.99,31.75 64.17,30.93 IC3.42
  Bottom 0.305: v18,24.13 17.36,24.77 v17.36,38.73
PG10  (via drill 0.5)
  Top 0.305: IC3.6 v40.81,28.53 | v38.95,38.1 38.32,38.73 18.63,38.73 18,38.1 18,36.83 18.63,36.2 19.27,36.2 19.39,36.07 U4.125 | R10.1 39.37,43.6 v38.95,43.18
  Bottom 0.305: v40.81,28.53 40.86,29.84 40.86,36.2 v38.95,38.1 v38.95,43.18
SWCLK  (via drill 0.5)  (1 unrouted)
  Top 0.305: U4.109 28.08,34.85 v28.16,34.92
  Bottom 0.305: v28.16,34.92 28.16,44.45
SWDIO  (via drill 0.5)  (1 unrouted)
  Top 0.305: U4.105 27.9,31.37 v26.89,32.38
  Bottom 0.305: v26.89,32.38 26.89,44.45
SWO  (1 unrouted)
UART_RX  (1 unrouted)
UART_TX  (1 unrouted)
USB_DM  (via drill 0.5)  (1 unrouted)
  Top 0.305: U4.103 32.5,30.38 v35.78,33.66
  Bottom 0.305: v35.78,33.66 35.78,42.55
USB_DP  (via drill 0.5)  (1 unrouted)
  Top 0.305: U4.104 31.74,30.89 v34.51,33.66
  Bottom 0.305: v34.51,33.66 35.14,34.29 35.14,42.55
USB_ID  (via drill 0.5)  (1 unrouted)
  Top 0.305: U4.102 33.26,29.87 v37.05,33.66
  Bottom 0.305: v37.05,33.66 37.05,42.55
USB_VBUS  (via drill 0.5)  (2 unrouted)
  Top 0.305: U4.101 34.05,29.39 v38.32,33.66
  Bottom 0.305: v38.32,33.66 37.68,34.29 37.68,42.55
VDDA
  Top 0.305: U4.33 9.36,16.89 9.74,16.51 9.74,15.24 7.2,12.7 L3.1 C18.1

### Text on the board
tPlace: 5v | gnd | 3v3 | PA3 | PA4 | PA5 | PA6 | PA7 | PC4 | PC5 | PB0 | PB1 | PB2 | Rebel Technology | OWL Rev02